# Altium schematic sheet Monitor.SchDoc
size A4; Organization: Altium Limited; Address1: L3, 12a Rodborough Rd; Address2: Frenchs Forest; Address3: NSW; Address4: Australia 2086; DocumentNumber: 6; SheetNumber: 6; SheetTotal: 8
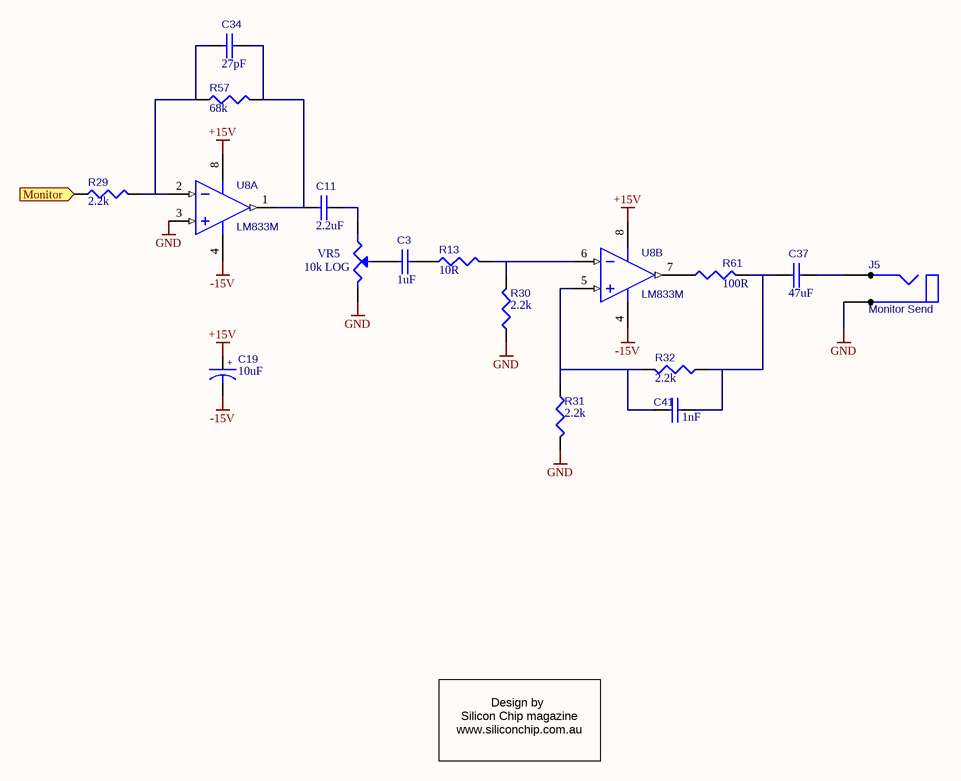
[diagram p0: Monitor.SchDoc]

## Parts
C3  1uF  [RB.2/.4-NP]
C11  2.2uF  [RB.2/.4-NP]
C19  10uF  [RB.2/.4]
C34  27pF  [RAD0.2]
C37  47uF  [RB.2/.4-NP]
C41  1nF  [RAD0.2]
J5  Monitor Send  [JACK-6.25MM]
R13  10R  [AXIAL0.4]
R29  2.2k  [AXIAL0.4]
R30  2.2k  [AXIAL0.4]
R31  2.2k  [AXIAL0.4]
R32  2.2k  [AXIAL0.4]
R57  68k  [AXIAL0.4]
R61  100R  [AXIAL0.4]
U8  LM833M  [DIP8]  (parts A,B of 2)
VR5  10k LOG  [POT - 24MM]

## Ports
Monitor (in)

## Nets
+15V: C19.1 U8.8(V+)
-15V: C19.2 U8.4(V-)
GND: J5.3(C) R30.1 R31.2 U8.3(IN1+) VR5.3
Monitor: R29.1 ; port Monitor
NetC3_1: C3.1 VR5.2(W)
NetC3_2: C3.2 R13.1
NetC11_1: C11.1 C34.2 R57.2 U8.1(OUT1)
NetC11_2: C11.2 VR5.1
NetC34_1: C34.1 R29.2 R57.1 U8.2(IN1-)
NetC37_1: C37.1 C41.2 R32.1 R61.2
NetC37_2: C37.2 J5.1(A)
NetC41_1: C41.1 R31.1 R32.2 U8.5(IN2+)
NetR13_2: R13.2 R30.2 U8.6(IN2-)
NetR61_1: R61.1 U8.7(OUT2)

## Notes on the sheet
- Design by
  Silicon Chip magazine
  www.siliconchip.com.au
- Title
- Size:
- Date:
- A4
- Number:
- Time:
- Revision:
- Sheet
- of
- File:
- (in symbol CAPACITOR POL) +

## Library data of the parts
C3 C11 C34 C37 C41 = CAP: Capacitor
  C34: Value: 27pF
C19 = CAPACITOR POL: Bi-Polar Capacitor; Value: 10uF
J5 = PHONEJACK MONO
R13 R29-R32 R57 R61 = RES1: Resistor
  R13: Value: 10R
  R29-R32: Value: 2.2k
  R57: Value: 68k
  R61: Value: 100R
U8 = LM833: Fast Settling Dual Operational Amplifier
VR5 = POT1: Potentiometer